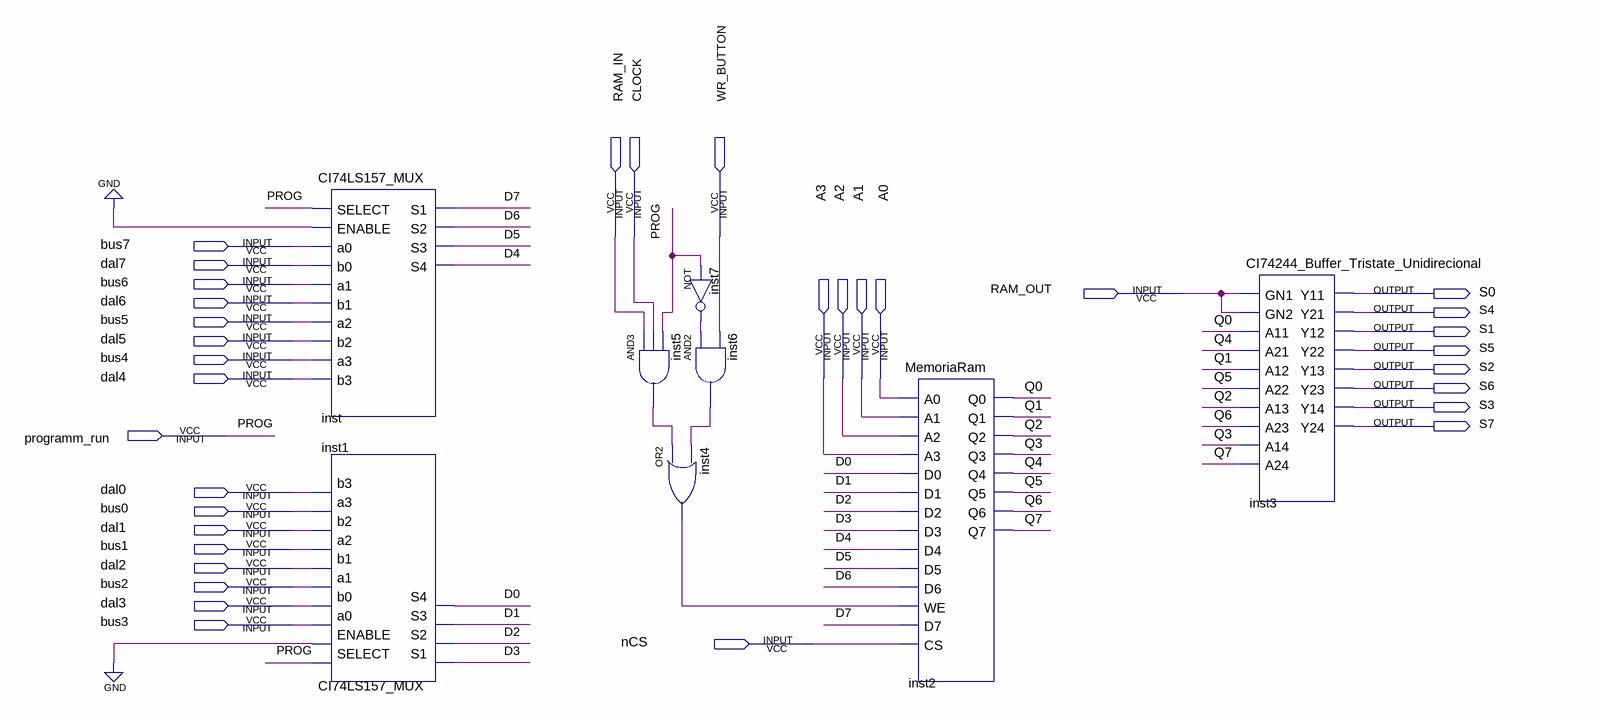
[diagram p0: schematic sheet]
// Quartus schematic Memoria_RAM_completa.bdf as structural Verilog: 8 symbols, 34 pins
module Memoria_RAM_completa (
  input  RAM_IN,
  input  CLOCK,
  input  WR_BUTTON,
  input  bus7,
  input  dal7,
  input  bus6,
  input  RAM_OUT,
  input  dal6,
  input  bus5,
  input  dal5,
  input  bus4,
  input  dal4,
  input  A3,
  input  A2,
  input  A1,
  input  A0,
  input  programm_run,
  input  dal0,
  input  bus0,
  input  dal1,
  input  bus1,
  input  dal2,
  input  bus2,
  input  dal3,
  input  bus3,
  input  nCS,
  output S0,
  output S4,
  output S1,
  output S5,
  output S2,
  output S6,
  output S3,
  output S7
);

  wire D0, D1, D2, D3, D4, D5, D6, D7, inst4_out, inst5_out, inst6_out, inst7_out, Q0, Q1, Q2, Q3, Q4, Q5,
       Q6, Q7;

  CI74LS157_MUX inst (
    .SELECT(programm_run), .ENABLE(1'b0), .a0(bus7), .b0(dal7), .a1(bus6), .b1(dal6), .a2(bus5), .b2(dal5),
    .a3(bus4), .b3(dal4), .S1(D7), .S2(D6), .S3(D5), .S4(D4));
  CI74LS157_MUX inst1 (
    .SELECT(programm_run), .ENABLE(1'b0), .a0(bus3), .b0(dal3), .a1(bus2), .b1(dal2), .a2(bus1), .b2(dal1),
    .a3(bus0), .b3(dal0), .S1(D3), .S2(D2), .S3(D1), .S4(D0));
  and inst5 (inst5_out, RAM_IN, CLOCK, programm_run);
  or inst4 (inst4_out, inst5_out, inst6_out);
  not inst7 (inst7_out, programm_run);
  and inst6 (inst6_out, inst7_out, WR_BUTTON);
  MemoriaRam inst2 (
    .A0(A0), .A1(A1), .A2(A2), .A3(A3), .D0(D0), .D1(D1), .D2(D2), .D3(D3), .D4(D4), .D5(D5), .D6(D6),
    .WE(inst4_out), .D7(D7), .CS(nCS), .Q0(Q0), .Q1(Q1), .Q2(Q2), .Q3(Q3), .Q4(Q4), .Q5(Q5), .Q6(Q6), .Q7(Q7));
  CI74244_Buffer_Tristate_Unidirecional inst3 (
    .GN1(RAM_OUT), .GN2(RAM_OUT), .A11(Q0), .A21(Q4), .A12(Q1), .A22(Q5), .A13(Q2), .A23(Q6), .A14(Q3),
    .A24(Q7), .Y11(S0), .Y21(S4), .Y12(S1), .Y22(S5), .Y13(S2), .Y23(S6), .Y14(S3), .Y24(S7));

  // Other names for the same wires on the sheet: PROG = programm_run
endmodule
